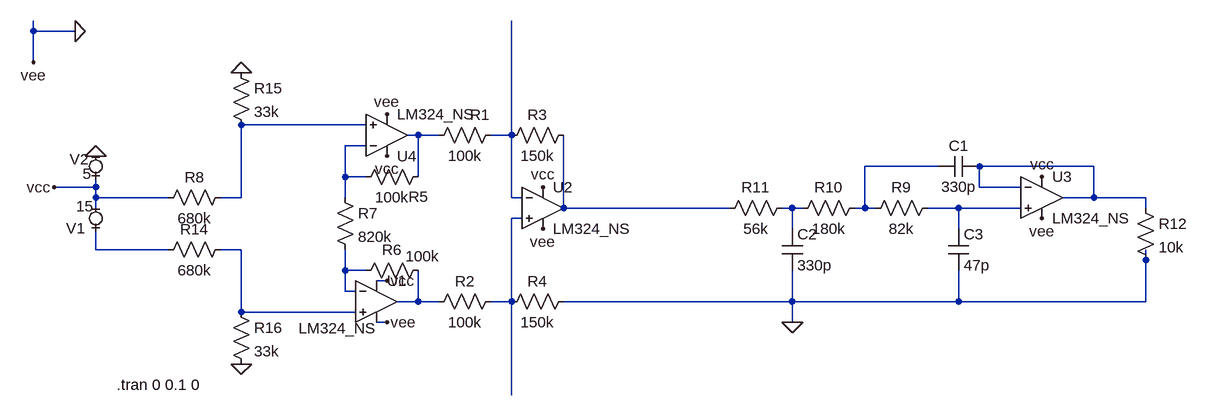
[diagram p0: schematic vin_sense.asc]
vin_sense.asc, the LTspice schematic file:
Version 4
SHEET 1 1376 680
WIRE -416 -160 -416 -176
WIRE -352 -160 -416 -160
WIRE -416 -112 -416 -160
WIRE 96 -16 -96 -16
WIRE 176 0 160 0
WIRE 208 0 176 0
WIRE 320 0 320 -176
WIRE 320 0 288 0
WIRE 96 16 64 16
WIRE 976 48 864 48
WIRE 1216 48 1040 48
WIRE 64 64 64 16
WIRE 96 64 64 64
WIRE 176 64 176 0
WIRE -320 80 -320 64
WIRE -320 80 -384 80
WIRE 1040 80 1040 48
WIRE 1104 80 1040 80
WIRE -320 96 -320 80
WIRE -208 96 -320 96
WIRE -96 96 -96 -16
WIRE -96 96 -128 96
WIRE 64 96 64 64
WIRE 320 96 320 0
WIRE 336 96 320 96
WIRE 1216 96 1216 48
WIRE 1216 96 1168 96
WIRE 1296 96 1216 96
WIRE -320 112 -320 96
WIRE 400 112 400 0
WIRE 656 112 400 112
WIRE 752 112 736 112
WIRE 768 112 752 112
WIRE 864 112 864 48
WIRE 864 112 848 112
WIRE 880 112 864 112
WIRE 1008 112 960 112
WIRE 1104 112 1008 112
WIRE 1296 112 1296 96
WIRE 336 128 320 128
WIRE 752 144 752 112
WIRE 1008 144 1008 112
WIRE -320 176 -320 144
WIRE -208 176 -320 176
WIRE -96 176 -128 176
WIRE 1296 192 1296 176
WIRE 64 208 64 176
WIRE 96 208 64 208
WIRE 128 224 112 224
WIRE 64 240 64 208
WIRE 80 240 64 240
WIRE 176 256 176 208
WIRE 176 256 144 256
WIRE 208 256 176 256
WIRE 320 256 320 128
WIRE 320 256 288 256
WIRE 752 256 752 208
WIRE 752 256 400 256
WIRE 1008 256 1008 208
WIRE 1008 256 752 256
WIRE 1296 256 1296 192
WIRE 1296 256 1008 256
WIRE -96 272 -96 176
WIRE 80 272 -96 272
WIRE 128 288 112 288
WIRE 752 288 752 256
WIRE 320 400 320 256
FLAG 128 32 vcc
FLAG 128 224 vcc
FLAG 368 80 vcc
FLAG 128 -32 vee
FLAG 368 144 vee
FLAG 128 288 vee
FLAG -320 32 0
FLAG -384 80 vcc
FLAG -416 -112 vee
FLAG 1136 64 vcc
FLAG 1136 128 vee
FLAG 752 288 0
FLAG -96 -96 0
FLAG -96 352 0
FLAG -352 -160 0
DATAFLAG 480 112 ""
DATAFLAG 32 -16 ""
DATAFLAG -16 272 ""
DATAFLAG 320 352 ""
DATAFLAG 320 -96 ""
DATAFLAG 1296 96 ""
SYMBOL res 192 16 R270
WINDOW 0 32 79 VTop 2
WINDOW 3 0 56 VBottom 2
SYMATTR InstName R1
SYMATTR Value 100k
SYMBOL res 192 272 R270
WINDOW 0 32 56 VTop 2
WINDOW 3 0 56 VBottom 2
SYMATTR InstName R2
SYMATTR Value 100k
SYMBOL res 304 16 R270
WINDOW 0 32 56 VTop 2
WINDOW 3 0 56 VBottom 2
SYMATTR InstName R3
SYMATTR Value 150k
SYMBOL res 304 272 R270
WINDOW 0 32 56 VTop 2
WINDOW 3 0 56 VBottom 2
SYMATTR InstName R4
SYMATTR Value 150k
SYMBOL res 192 48 R90
WINDOW 0 62 15 VBottom 2
WINDOW 3 32 56 VTop 2
SYMATTR InstName R5
SYMATTR Value 100k
SYMBOL res 192 192 R90
WINDOW 0 0 56 VBottom 2
WINDOW 3 -21 9 VTop 2
SYMATTR InstName R6
SYMATTR Value 100k
SYMBOL MiniSyms4\\voltage- -320 48 R180
WINDOW 0 11 11 Left 2
WINDOW 3 7 -11 Left 2
SYMATTR InstName V2
SYMATTR Value 5
SYMBOL cap 976 64 R270
WINDOW 0 32 32 VTop 2
WINDOW 3 0 32 VBottom 2
SYMATTR InstName C1
SYMATTR Value 330p
SYMBOL res 864 128 R270
WINDOW 0 32 56 VTop 2
WINDOW 3 0 56 VBottom 2
SYMATTR InstName R9
SYMATTR Value 82k
SYMBOL res 752 128 R270
WINDOW 0 32 56 VTop 2
WINDOW 3 0 56 VBottom 2
SYMATTR InstName R10
SYMATTR Value 180k
SYMBOL res 640 128 R270
WINDOW 0 32 56 VTop 2
WINDOW 3 0 56 VBottom 2
SYMATTR InstName R11
SYMATTR Value 56k
SYMBOL cap 736 144 R0
SYMATTR InstName C2
SYMATTR Value 330p
SYMBOL cap 992 144 R0
SYMATTR InstName C3
SYMATTR Value 47p
SYMBOL EXTRA\\ExtraOpamps\\LM324_NS 112 256 R0
WINDOW 3 -120 41 Left 2
SYMATTR InstName U1
SYMBOL EXTRA\\ExtraOpamps\\LM324_NS 368 112 R0
SYMATTR InstName U2
SYMBOL EXTRA\\ExtraOpamps\\LM324_NS 1136 96 R0
SYMATTR InstName U3
SYMBOL EXTRA\\ExtraOpamps\\LM324_NS 128 0 M180
SYMATTR InstName U4
SYMBOL res 48 80 R0
SYMATTR InstName R7
SYMATTR Value 820k
SYMBOL res 1280 96 R0
SYMATTR InstName R12
SYMATTR Value 10k
SYMBOL res -224 112 R270
WINDOW 0 32 56 VTop 2
WINDOW 3 0 56 VBottom 2
SYMATTR InstName R8
SYMATTR Value 680k
SYMBOL MiniSyms4\\voltage- -320 128 R180
WINDOW 0 16 -15 Left 2
WINDOW 3 3 19 Left 2
WINDOW 123 0 0 Left 2
WINDOW 39 0 0 Left 2
SYMATTR InstName V1
SYMATTR Value 15
SYMBOL res -224 192 R270
WINDOW 0 32 56 VTop 2
WINDOW 3 0 56 VBottom 2
SYMATTR InstName R14
SYMATTR Value 680k
SYMBOL res -112 -112 R0
SYMATTR InstName R15
SYMATTR Value 33k
SYMBOL res -112 256 R0
SYMATTR InstName R16
SYMATTR Value 33k
TEXT -288 384 Left 2 !.tran 0 0.1 0

The netlist it stands for:
* vin_sense.asc
R1 N002 N003 100k
R2 N014 N010 100k
R3 N003 N007 150k
R4 N010 0 150k
R5 N002 N004 100k
R6 N014 N013 100k
V2 vcc 0 5
C1 N005 N006 330p
R9 N005 N009 82k
R10 N008 N005 180k
R11 N007 N008 56k
C2 N008 0 330p
C3 N009 0 47p
* U1: LM324_NS (symbol EXTRA\ExtraOpamps\LM324_NS not available, pins judged from their places): In+=N012 In-=N013 V+=vcc V-=0 OUT=N014
* U2: LM324_NS (symbol EXTRA\ExtraOpamps\LM324_NS not available, pins judged from their places): In+=N010 In-=N003 V+=vcc V-=0 OUT=N007
* U3: LM324_NS (symbol EXTRA\ExtraOpamps\LM324_NS not available, pins judged from their places): In+=N009 In-=N006 V+=vcc V-=0 OUT=N006
* U4: LM324_NS (symbol EXTRA\ExtraOpamps\LM324_NS not available, pins judged from their places): In+=N001 In-=N004 V+=vcc V-=0 OUT=N002
R7 N004 N013 820k
R12 N006 0 10k
R8 vcc N001 680k
V1 N011 vcc 15
R14 N011 N012 680k
R15 0 N001 33k
R16 N012 0 33k
.tran 0 0.1 0
.backanno
.end